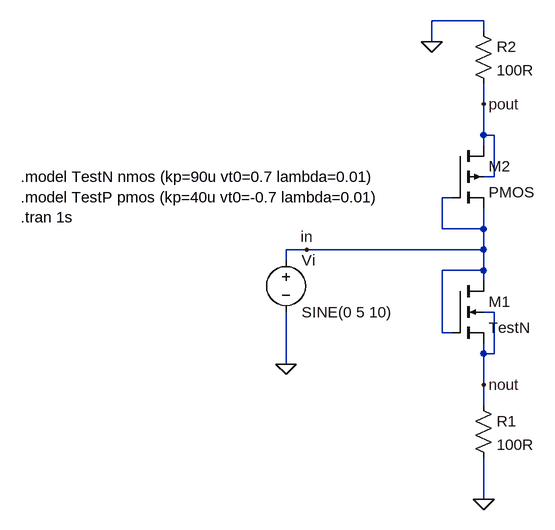
[diagram p0: schematic diode.asc]
diode.asc, the LTspice schematic file:
Version 4
SHEET 1 880 680
WIRE 320 -96 240 -96
WIRE 320 -80 320 -96
WIRE 240 -64 240 -96
WIRE 320 32 320 0
WIRE 320 80 320 32
WIRE 336 80 320 80
WIRE 320 96 320 80
WIRE 336 144 336 80
WIRE 336 144 320 144
WIRE 272 176 256 176
WIRE 256 224 256 176
WIRE 320 224 320 192
WIRE 320 224 256 224
WIRE 48 256 16 256
WIRE 320 256 320 224
WIRE 320 256 48 256
WIRE 16 272 16 256
WIRE 320 288 320 256
WIRE 320 288 256 288
WIRE 320 304 320 288
WIRE 336 352 320 352
WIRE 256 384 256 288
WIRE 272 384 256 384
WIRE 320 416 320 400
WIRE 336 416 336 352
WIRE 336 416 320 416
WIRE 16 432 16 352
WIRE 320 464 320 416
WIRE 320 496 320 464
WIRE 320 640 320 576
FLAG 16 432 0
FLAG 48 256 in
FLAG 320 640 0
FLAG 240 -64 0
FLAG 320 464 nout
FLAG 320 32 pout
SYMBOL nmos4 272 304 R0
SYMATTR InstName M1
SYMATTR Value TestN
SYMATTR Value2 l=10u w=10u
SYMBOL voltage 16 256 R0
WINDOW 123 0 0 Left 2
WINDOW 39 0 0 Left 2
SYMATTR InstName Vi
SYMATTR Value SINE(0 5 10)
SYMBOL res 304 480 R0
SYMATTR InstName R1
SYMATTR Value 100R
SYMBOL pmos4 272 96 R0
SYMATTR InstName M2
SYMBOL res 304 -96 R0
SYMATTR InstName R2
SYMATTR Value 100R
TEXT -392 144 Left 2 !.model TestN nmos (kp=90u vt0=0.7 lambda=0.01)\n.model TestP pmos (kp=40u vt0=-0.7 lambda=0.01)\n.tran 1s

The netlist it stands for:
* diode.asc
M1 in in nout nout TestN l=10u w=10u
Vi in 0 SINE(0 5 10)
R1 nout 0 100R
M2 pout in in pout PMOS
R2 0 pout 100R
.model NMOS NMOS
.model PMOS PMOS
.lib standard.mos
.model TestN nmos (kp=90u vt0=0.7 lambda=0.01)
.model TestP pmos (kp=40u vt0=-0.7 lambda=0.01)
.tran 1s
.backanno
.end